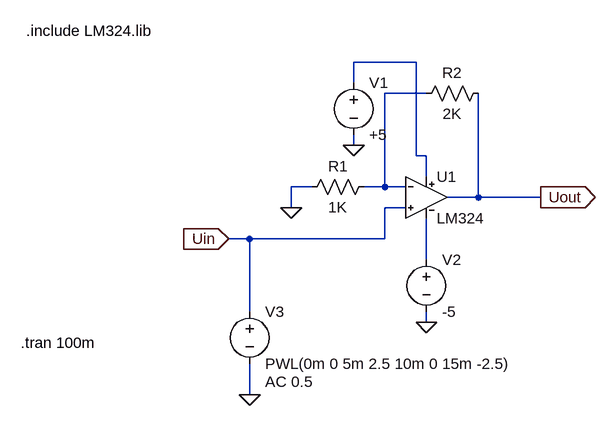
[diagram p0: schematic 2_1_a.asc]
2_1_a.asc, the LTspice schematic file:
Version 4.1
SHEET 1 900 680
WIRE 304 -64 208 -64
WIRE 208 -32 208 -64
WIRE 320 -16 256 -16
WIRE 208 64 208 48
WIRE 304 80 304 -64
WIRE 320 80 304 80
WIRE 320 112 320 80
WIRE 144 128 112 128
WIRE 256 128 256 -16
WIRE 256 128 224 128
WIRE 288 128 256 128
WIRE 400 144 400 -16
WIRE 400 144 352 144
WIRE 496 144 400 144
WIRE 112 160 112 128
WIRE 288 160 256 160
WIRE 48 208 16 208
WIRE 256 208 256 160
WIRE 256 208 48 208
WIRE 320 240 320 176
WIRE 48 320 48 208
WIRE 320 336 320 320
WIRE 48 448 48 400
FLAG 112 160 0
FLAG 208 64 0
FLAG 320 336 0
FLAG 16 208 Uin
IOPIN 16 208 In
FLAG 496 144 Uout
IOPIN 496 144 Out
FLAG 48 448 0
SYMBOL LM324 320 144 R0
SYMATTR InstName U1
SYMBOL res 240 112 R90
WINDOW 0 0 56 VBottom 2
WINDOW 3 32 56 VTop 2
SYMATTR InstName R1
SYMATTR Value 1K
SYMATTR SpiceLine tol=1 pwr=0.1
SYMBOL res 416 -32 R90
WINDOW 0 0 56 VBottom 2
WINDOW 3 32 56 VTop 2
SYMATTR InstName R2
SYMATTR Value 2K
SYMATTR SpiceLine tol=1 pwr=0.1
SYMBOL voltage 208 -48 R0
WINDOW 123 0 0 Left 0
WINDOW 39 0 0 Left 0
SYMATTR InstName V1
SYMATTR Value +5
SYMBOL voltage 320 224 R0
WINDOW 123 0 0 Left 0
WINDOW 39 0 0 Left 0
SYMATTR InstName V2
SYMATTR Value -5
SYMBOL voltage 48 304 R0
WINDOW 123 24 124 Left 2
WINDOW 39 0 0 Left 0
SYMATTR InstName V3
SYMATTR Value PWL(0m 0 5m 2.5 10m 0 15m -2.5)
SYMATTR Value2 AC 0.5
TEXT -296 -112 Left 2 !.include LM324.lib
TEXT -304 368 Left 2 !.tran 100m

The netlist it stands for:
* 2_1_a.asc
X§U1 Uin N002 N001 N003 Uout LM324  ; pins In+ In- V+ V- OUT
R1 N002 0 1K tol=1 pwr=0.1
R2 Uout N002 2K tol=1 pwr=0.1
V1 N001 0 +5
V2 N003 0 -5
V3 Uin 0 PWL(0m 0 5m 2.5 10m 0 15m -2.5) AC 0.5
.include LM324.lib
.tran 100m
.backanno
.end